# EAGLE design emetteurRG (EAGLE 6.6.0)
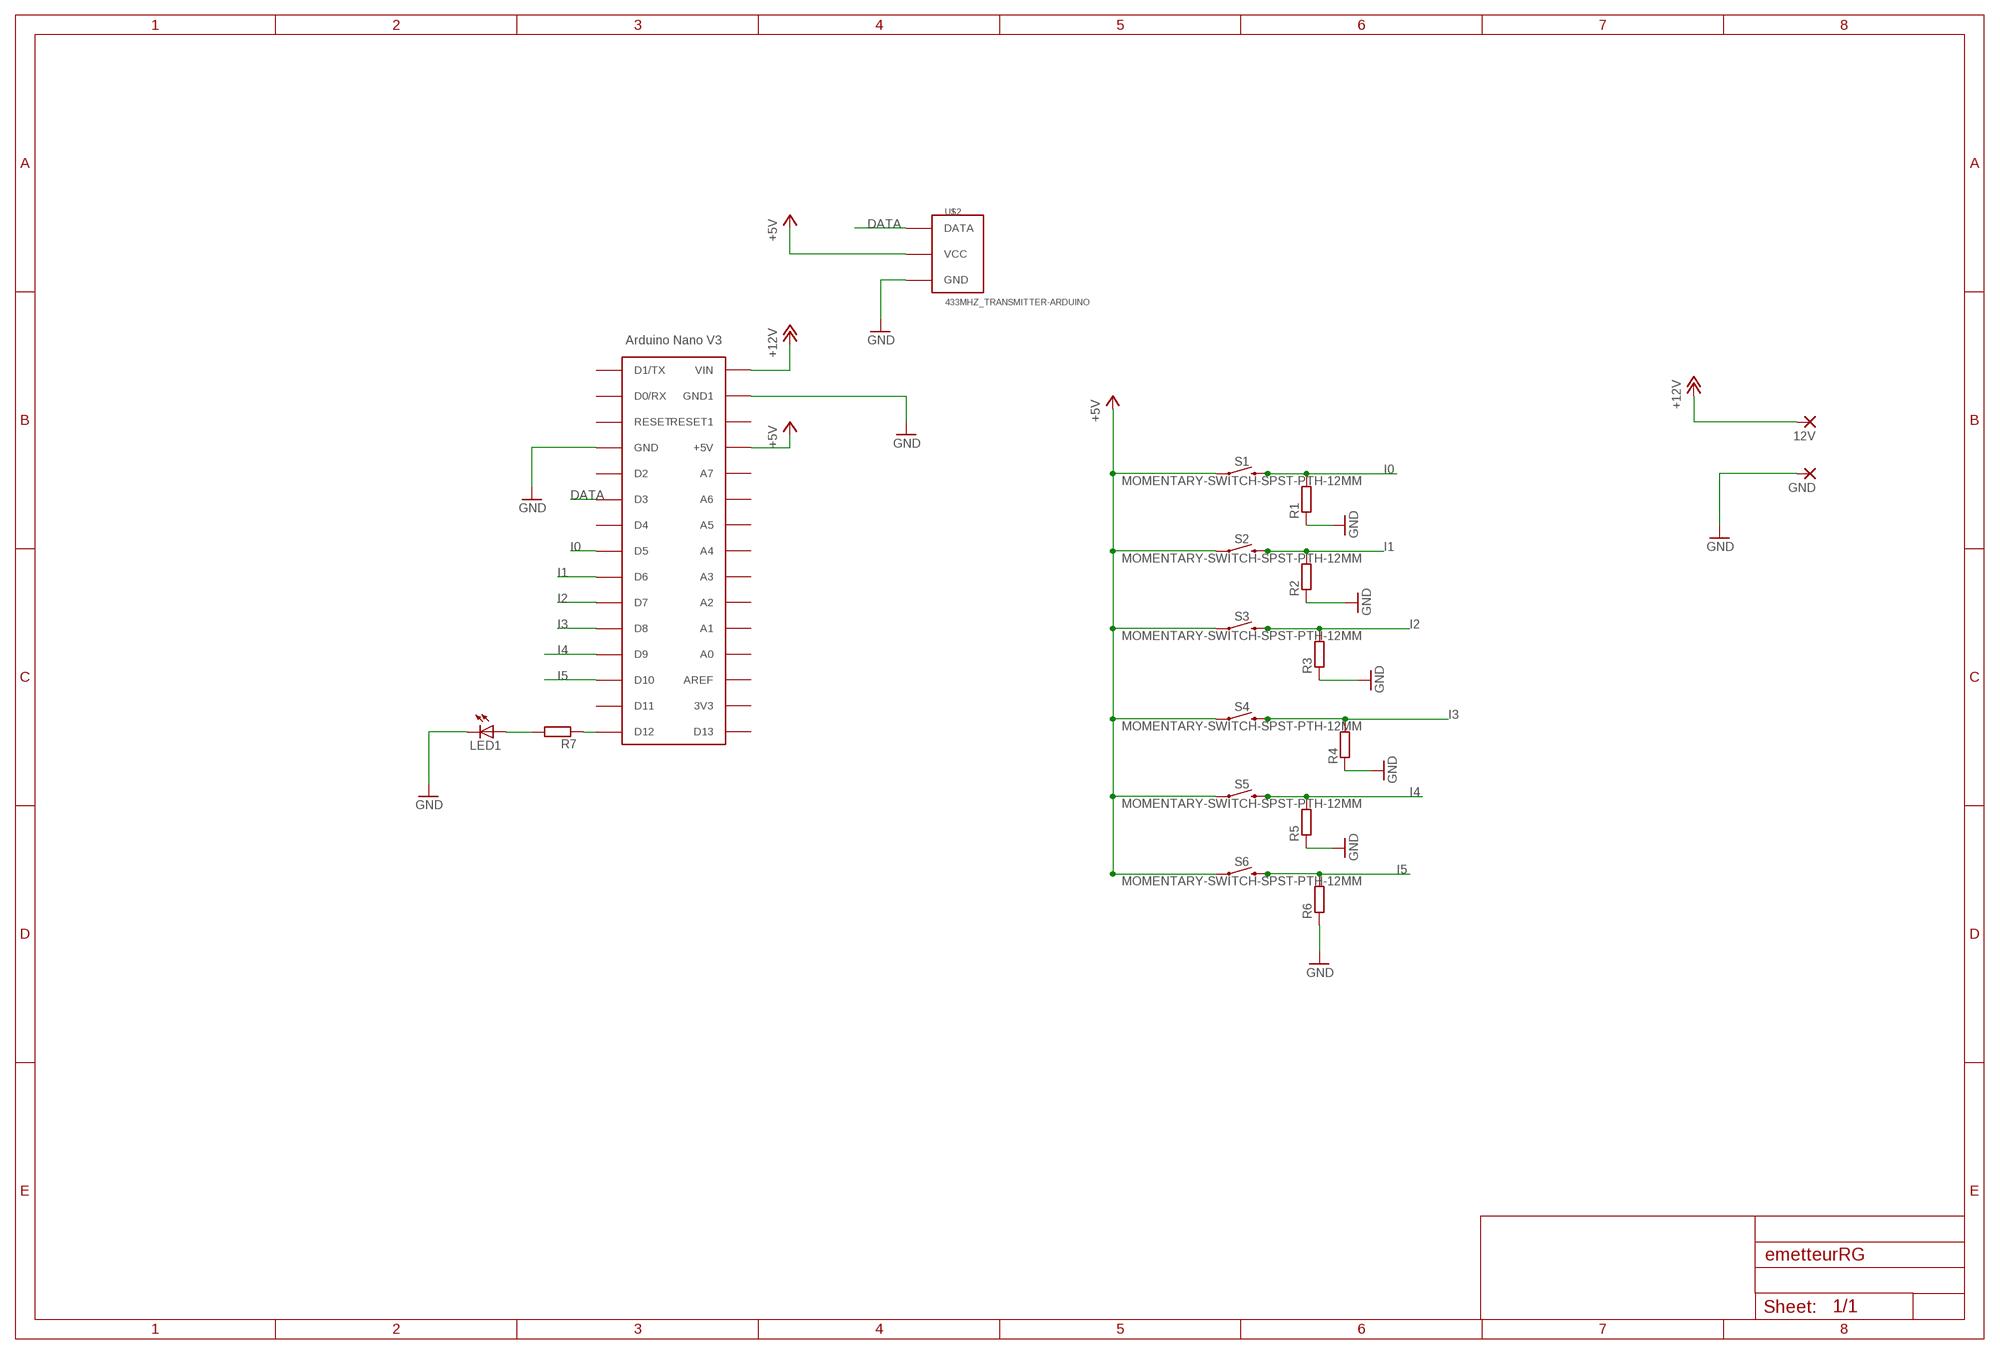
[diagram p0: schematic, sheet 1]

## Parts
12V  SMD5  [SMD2,54-5,08]
GND  SMD5  [SMD2,54-5,08]
LED1  LED5MM  [LED5MM]
R1  R-EU_R1206  [R1206]
R2  R-EU_R1206  [R1206]
R3  R-EU_R1206  [R1206]
R4  R-EU_R1206  [R1206]
R5  R-EU_R1206  [R1206]
R6  R-EU_R1206  [R1206]
R7  R-EU_R1206  [R1206]
S1  MOMENTARY-SWITCH-SPST-PTH-12MM  [TACTILE_SWITCH_PTH_12MM]
S2  MOMENTARY-SWITCH-SPST-PTH-12MM  [TACTILE_SWITCH_PTH_12MM]
S3  MOMENTARY-SWITCH-SPST-PTH-12MM  [TACTILE_SWITCH_PTH_12MM]
S4  MOMENTARY-SWITCH-SPST-PTH-12MM  [TACTILE_SWITCH_PTH_12MM]
S5  MOMENTARY-SWITCH-SPST-PTH-12MM  [TACTILE_SWITCH_PTH_12MM]
S6  MOMENTARY-SWITCH-SPST-PTH-12MM  [TACTILE_SWITCH_PTH_12MM]
U$1  ARDUINONANO  [PDIP-32]
U$2  433MHZ_TRANSMITTER-ARDUINO  [433MHZ_TRANSMITTER-ARDUINO]

## Nets
+5V: S1.1 S2.1 S3.1 S4.1 S5.1 S6.1 U$1.+5V U$2.VCC
+12V: 12V.1(P) U$1.VIN
DATA: U$1.D3 U$2.DATA
GND: GND.1(P) LED1.K(C) R1.1 R2.1 R3.1 R4.1 R5.1 R6.1 U$1.GND U$1.GND1 U$2.GND
I0: R1.2 S1.3 U$1.D5
I1: R2.2 S2.3 U$1.D6
I2: R3.2 S3.3 U$1.D7
I3: R4.2 S4.3 U$1.D8
I4: R5.2 S5.3 U$1.D9
I5: R6.2 S6.3 U$1.D10
N$1: LED1.A R7.2
N$2: R7.1 U$1.D12
Unconnected: U$1.3V3 U$1.A0(A7) U$1.A1(A6) U$1.A2(A5) U$1.A3(A4) U$1.A4(A3) U$1.A5(A2) U$1.A6(A1) U$1.A7(A0) U$1.AREF U$1.D0/RX U$1.D1/TX U$1.D2 U$1.D4 U$1.D11 U$1.D13 U$1.RESET U$1.RESET1

## Library data of the parts
12V GND = wirepad:SMD5: SMD PAD
LED1 = led:LED: LED OSRAM: - CHIPLED LG R971, LG N971, LY N971, LG Q971, LY Q971, LO R971, LY R971 LH N974, LH R974 LS Q976, LO Q976, LY Q976 LO Q996 - Hyper CHIPLED LW Q18S LB Q993, LB Q99A, LB R99A - SideLED LS A670, LO A670, LY A670, LG A670, LP A670 LB A673, LV A673, LT A673, LW A673 LH A674 LY A675 LS A676, LA A676, LO A676, LY A676, LW A676 LS A679, LY A679, LG A679 - Hyper Micro SIDELED® LS Y876, LA Y876, LO Y876, LY Y876 LT Y87S - SmartLED LW L88C, LW L88S LB L89C, LB L89S, LG L890 LS L89K, LO L89K, LY L89K LS L896, LA L896, LO L896, LY L896 - TOPLED LS T670, LO T670, LY T670, LG T670, LP T670 LSG T670, LSP T670, LSY T670, LOP T670, LYG T670 LG T671, LOG T671, LSG T671 LB T673, LV T673, LT T673, LW T673 LH T674 LS T676, LA T676, LO T676, LY T676, LB T676, LH T676, LSB T676, LW T676 LB T67C, LV T67C, LT T67C, LS T67K, LO T67K, LY T67K, LW E67C LS E67B, LA E67B, LO E67B, LY E67B, LB E67C, LV E67C, LT E67C LW T67C LS T679, LY T679, LG T679 LS T770, LO T770, LY T770, LG T770, LP T770 LB T773, LV T773, LT T773, LW T773 LH T774 LS E675, LA E675, LY E675, LS T675 LS T776, LA T776, LO T776, LY T776, LB T776 LHGB T686 LT T68C, LB T68C - Hyper Mini TOPLED® LB M676 - Mini TOPLED Santana® LG M470 LS M47K, LO M47K, LY M47K Source: http://www.osram.convergy.de LUXEON: - LUMILED® LXK2-PW12-R00, LXK2-PW12-S00, LXK2-PW14-U00, LXK2-PW14-V00 LXK2-PM12-R00, LXK2-PM12-S00, LXK2-PM14-U00 LXK2-PE12-Q00, LXK2-PE12-R00, LXK2-PE12-S00, LXK2-PE14-T00, LXK2-PE14-U00 LXK2-PB12-K00, LXK2-PB12-L00, LXK2-PB12-M00, LXK2-PB14-N00, LXK2-PB14-P00, LXK2-PB14-Q00 LXK2-PR12-L00, LXK2-PR12-M00, LXK2-PR14-Q00, LXK2-PR14-R00 LXK2-PD12-Q00, LXK2-PD12-R00, LXK2-PD12-S00 LXK2-PH12-R00, LXK2-PH12-S00 LXK2-PL12-P00, LXK2-PL12-Q00, LXK2-PL12-R00 Source: www.luxeon.com KINGBRIGHT: KA-3528ASYC Source: www.kingbright.com
R1-R7 = rcl:R-EU_: RESISTOR, European symbol
S1-S6 = SparkFun-Switches:MOMENTARY-SWITCH-SPST: Momentary Switch (Pushbutton) - SPST Normally-open (NO) SPST momentary switches (buttons, pushbuttons). Variants PTH-12MM - 12mm square, through-hole Momentary Pushbutton Switch - 12mm Square <https://www.sparkfun.com/products/9190> (COM-09190) PTH-6.0MM, PTH-6.0MM-KIT - 6.0mm square, through-hole Mini Pushbutton Switch <https://www.sparkfun.com/products/97> (COM-00097) KIT package intended for soldering kit's - only one side of pads' copper is exposed. PTH-RIGHT-ANGLE-KIT - Right-angle, through-hole Right Angle Tactile Button <https://www.sparkfun.com/products/10791> - Used on SparkFun BigTime Watch Kit <https://www.sparkfun.com/products/11734> SMD-12MM - 12mm square, surface-mount Tactile Button - SMD (12mm) <https://www.sparkfun.com/products/12993> (COM-12993) Used on SparkFun PicoBoard <https://www.sparkfun.com/products/11888> SMD-4.5MM - 4.5mm Square Trackball Switch Used on SparkFun Blackberry Trackballer Breakout <https://www.sparkfun.com/products/13169> SMD-4.6MMX2.8MM - 4.60mm x 2.80mm, surface mount Used on SparkFun SAMD21 Mini Breakout <https://www.sparkfun.com/products/13664> SMD-5.2MM, SMD-5.2-REDUNDANT - 5.2mm square, surface-mount Mini Pushbutton Switch - SMD <https://www.sparkfun.com/products/8720> (COM-08720) Used on Arduino Pro Mini <https://www.sparkfun.com/products/11114> REDUNDANT package connects both switch circuits together SMD-6.0X3.5MM - 6.0 x 3.5mm, surface mount Momentary Reset Switch SMD <https://www.sparkfun.com/products/8229> (COM-08229) SMD-6.2MM-TALL - 6.2mm square, surface mount Tactile Button - SMD (6mm) <https://www.sparkfun.com/products/12992> Used on SparkFun Digital Sandbox <https://www.sparkfun.com/products/12651> SMD-RIGHT-ANGLE - Right-angle, surface mount Used on SparkFun Block for Intel® Edison - Arduino <https://www.sparkfun.com/products/13036>; PROD_ID: SWCH-09185; SF_SKU: COM-09190
U$1 = CRE-Lib1:ARDUINONANO: Arduino Nano
U$2 = BaseApp:433MHZ_TRANSMITTER-ARDUINO

## Board
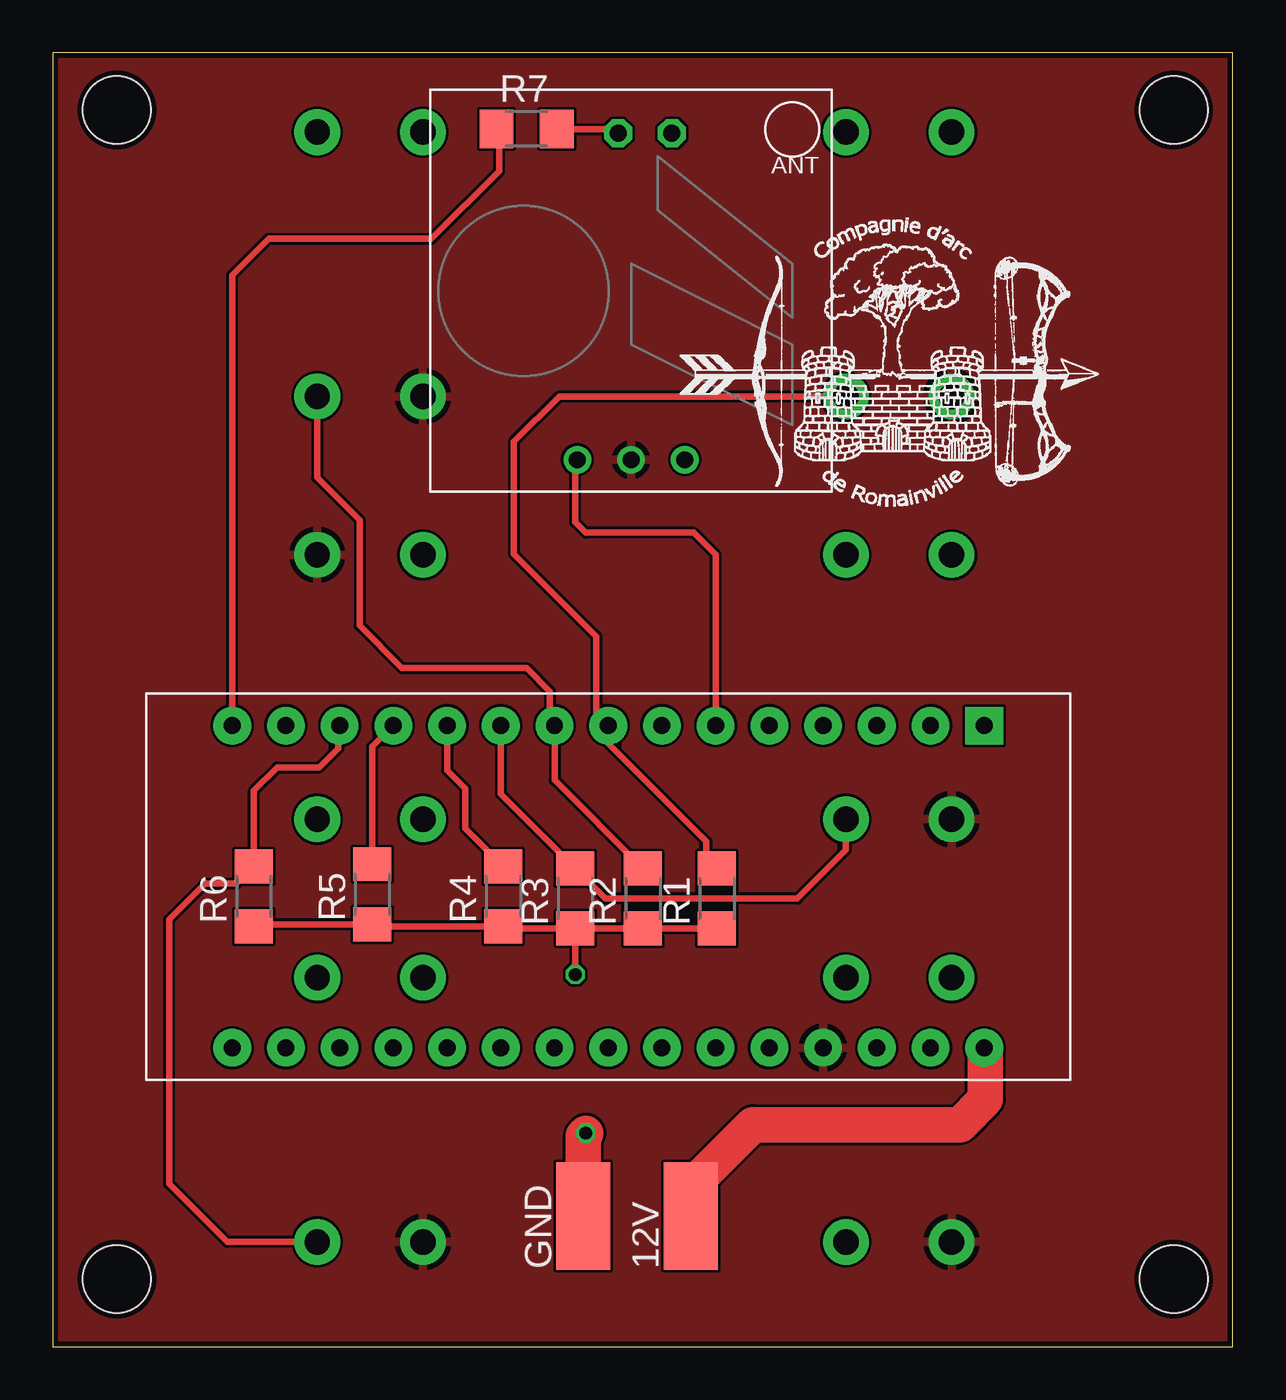
[diagram p1: board, top side]
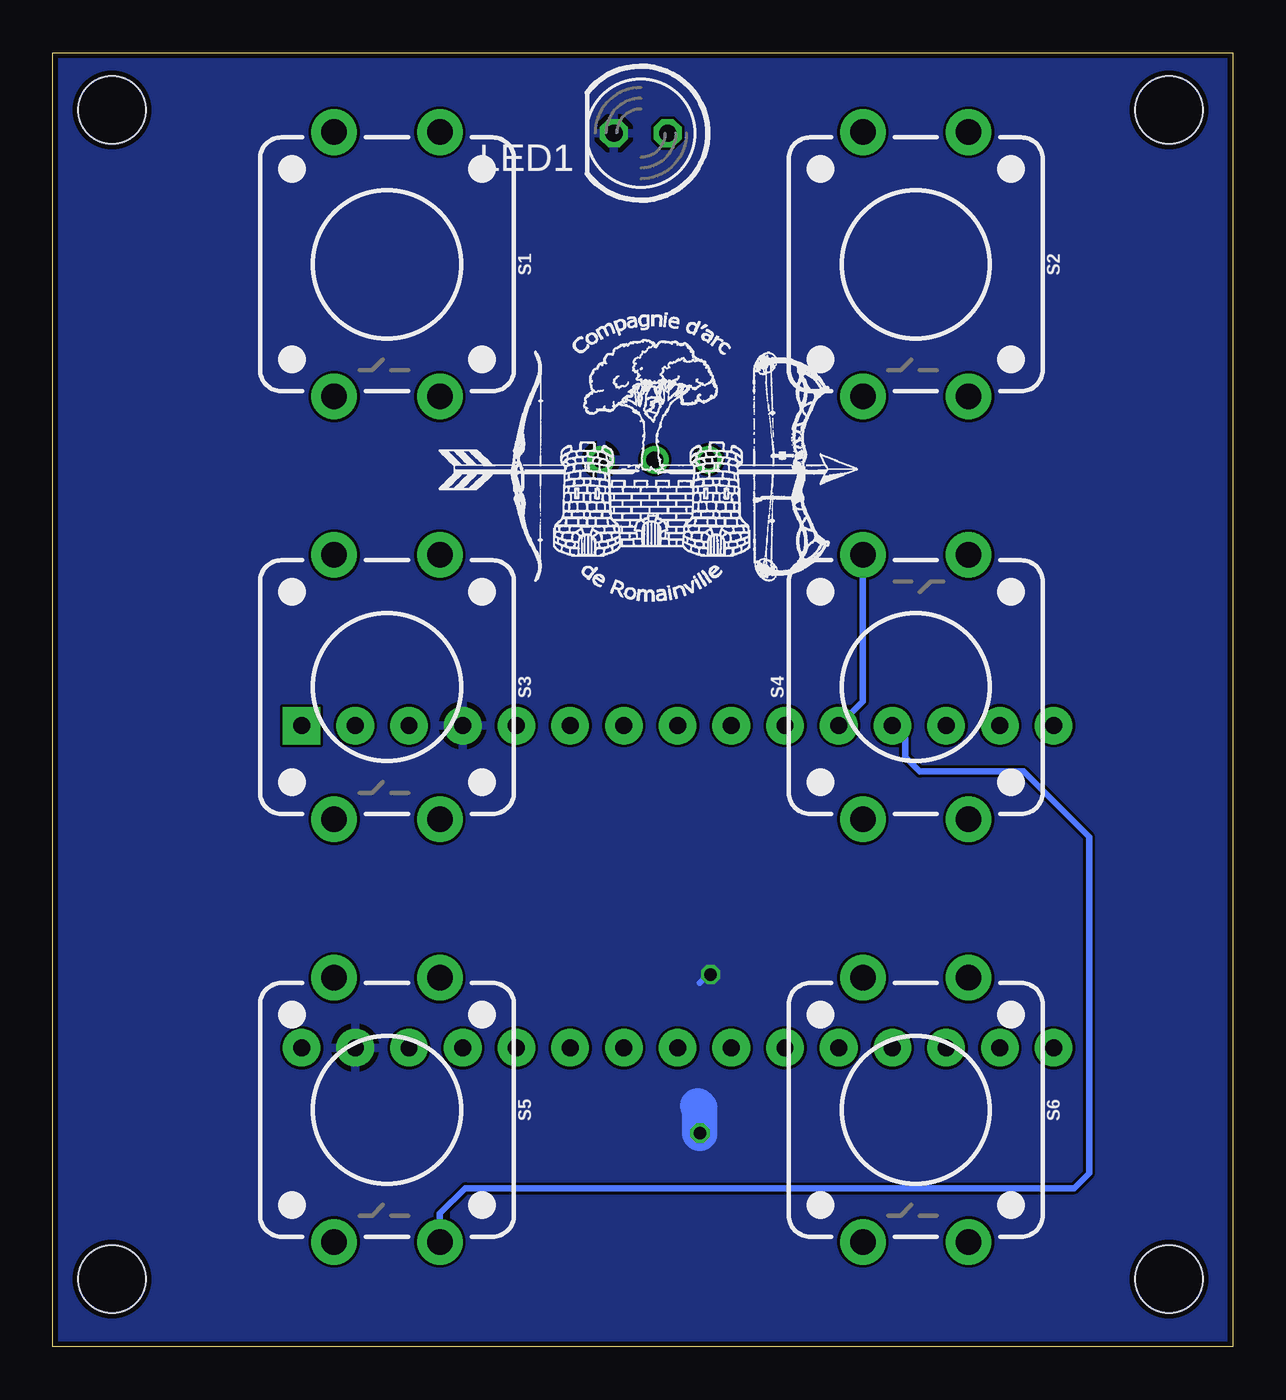
[diagram p2: board, bottom side, seen from below]

Size 55.8 x 61.2 mm. Coordinates in mm from the lower left corner, seen from the top.
Outline: 0,0 55.8,0 55.8,61.2 0,61.2 0,0
Copper layers (1*16): Top 0.035mm / dielectric 1.5mm / Bottom 0.035mm
Design rules "dirt_cheap_dirty_boards.v1": minimum track width 5mil, minimum drill 12mil, track to track 5mil, track to pad 5mil, pad to pad 5mil, via to via 5mil, smd to smd 0mil, copper to edge 10mil, drill to drill 10mil, minimum pad ring 10mil, minimum via ring 6mil, stop-mask expansion 2mil, vias tented up to drill 25mil, thermal gap 10mil
Holes 3.2 mm at 3.02,58.5 53,58.5 53,3.2 3.02,3.2

### Footprints (pad centres in the part's own frame; a part is rotated, then mirrored left to right if it is on the bottom)
SMD2,54-5,08 = smd 2.54 x 5.08: 1 0,0
LED5MM = drill 0.813 octagon: A -1.27,0; K 1.27,0
R1206 = smd 1.6 x 1.803: 1 -1.422,0; 2 1.422,0
TACTILE_SWITCH_PTH_12MM = drill 1.2 pad 2.159: 1 6.25,-2.5; 2 -6.25,-2.5; 3 6.25,2.5; 4 -6.25,2.5
PDIP-32 = drill 0.8 pad 1.778: 3V3 15.24,-35.56; +5V 15.24,-10.16; A0 15.24,-12.7; A1 15.24,-15.24; A2 15.24,-17.78; A3 15.24,-20.32; A4 15.24,-22.86; A5 15.24,-25.4; A6 15.24,-27.94; A7 15.24,-30.48; AREF 15.24,-33.02; D0/RX 0,-5.08; D2 0,-12.7; D3 0,-15.24; D4 0,-17.78; D5 0,-20.32; D6 0,-22.86; D7 0,-25.4; D8 0,-27.94; D9 0,-30.48; D10 0,-33.02; D11 0,-35.56; D12 0,-38.1; D13 15.24,-38.1; GND 0,-10.16; GND1 15.24,-5.08; RESET 0,-7.62; RESET1 15.24,-7.62; VIN 15.24,-2.54 | drill 0.8 pad 1.778 square: D1/TX 0,-2.54
433MHZ_TRANSMITTER-ARDUINO = drill 0.8: DATA 2.54,8; GND -2.54,8; VCC 0,8

### Placement (x,y rotation side)
12V  30.16,6.18 0 top
GND  25.08,6.18 0 top
LED1  28,57.4 180 bottom
R1  31.4,21.2 90 top
R2  27.9,21.2 90 top
R3  24.7,21.2 90 top
R4  21.3,21.3 90 top
R5  15.1,21.4 90 top
R6  9.5,21.3 90 top
R7  22.4,57.6 0 top
S1  40,51.2 270 bottom
S2  15,51.2 270 bottom
S3  40,31.2 270 bottom
S4  15,31.2 90 bottom
S5  40,11.2 270 bottom
S6  15,11.2 270 bottom
U$1  46.58,29.38 270 top
U$2  27.34,49.95 180 top
U$3  [LOGO]  29.3,39.2 0 top
U$4  [LOGO]  37.9,34.7 0 bottom

### Tracks (layer width: path | path; a pad name or v marks a point on that pad's centre or on a via)
+5V
  pour Top: 59.1,63.7 59.1,-3.2 -2.4,-3.2 -2.4,63.7
+12V
  Top 1.676: 12V.1 30.16,7.56 33.1,10.5 42.9,10.5 44.1,11.7 44.1,14.08 U$1.VIN
DATA
  Top 0.305: U$1.D3 31.34,37.46 30.3,38.5 25.2,38.5 24.7,39 24.7,41.85 U$2.DATA
GND  (via drill 0.6)
  Top 0.305: R1.1 R2.1 R3.1 | R3.1 21.4,19.78 R4.1 15.2,19.88 R5.1 9.6,19.98 R6.1 | R3.1 v24.7,17.6
  Top 1.676: GND.1 25.08,9.98 v25.2,10.1
  Bottom 0.305: v24.7,17.6 24.8,17.6 25.2,17.2
  Bottom 1.676: v25.2,10.1 25.2,11.3 25.3,11.4
  pour Bottom: -0.9,61.9 56.7,61.9 56.7,-1 -0.9,-1
I0
  Top 0.305: R1.2 30.9,23.12 30.9,23.9 26.26,28.54 U$1.D5 25.7,29.94 25.7,33.6 21.8,37.5 21.8,42.8 23.95,44.95 S1.3
I1
  Top 0.305: R2.2 23.72,26.8 U$1.D6 23.5,29.6 23.5,31 22.4,32.1 16.5,32.1 14.5,34.1 14.5,39.1 12.5,41.1 S2.3
I2
  Top 0.305: U$1.D7 21.18,26.14 R3.2 | R3.2 24.72,22.62 24.9,22.8 | S3.3 37.5,23.5 35.2,21.2 26.12,21.2 R3.2
I3
  Top 0.305: U$1.D8 18.64,27.26 19.5,26.4 19.5,24.52 R4.2
  Bottom 0.305: S4.3 17.5,30.52 U$1.D8
I4
  Top 0.305: R5.2 15.1,28.38 U$1.D9
  Bottom 0.305: S5.3 37.5,6.3 36.3,7.5 7.5,7.5 6.8,8.2 6.8,24.1 9.9,27.2 14.8,27.2 15.5,27.9 15.5,28.78 U$1.D9
I5
  Top 0.305: S6.3 8.25,4.95 5.5,7.7 5.5,20.2 7.2,21.9 8.68,21.9 R6.2 9.5,26.3 10.6,27.4 12.6,27.4 13.5,28.3 13.5,29.32 U$1.D10
N$1
  Top 0.305: R7.2 26.53,57.6 LED1.A
N$2
  Top 0.305: U$1.D12 8.48,50.68 10.2,52.4 17.9,52.4 21.1,55.6 21.1,57.48 R7.1